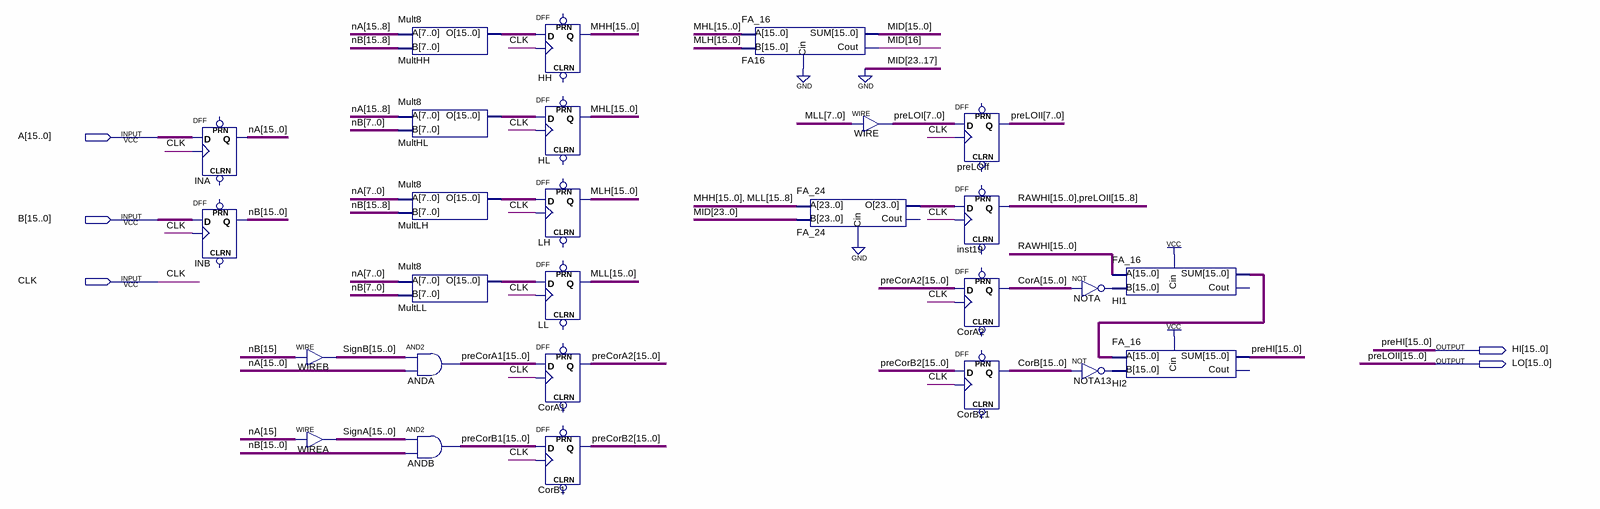
[diagram p0: schematic sheet]
// Quartus schematic Mult16bit_L3.bdf as structural Verilog: 27 symbols, 5 pins
module Mult16bit_L3 (
  input  [15:0] A,
  input  [15:0] B,
  input  CLK,
  output [15:0] HI,
  output [15:0] LO
);

  wire [7:0] preLOI;
  wire [15:0] CorA, CorB, HI1_sum, MHH, MHL, MLH, MLL, MultHH_o, MultHL_o, MultLH_o, MultLL_o, nA, nB,
       NOTA13_out, NOTA_out, preCorA1, preCorA2, preCorB1, preCorB2, RAWHI, SignA, SignB;
  wire [16:0] MID;
  wire [23:0] FA_24_o;

  DFF INA[15:0] (.CLK(CLK), .D(A), .Q(nA));  // open: CLRN, PRN
  DFF INB[15:0] (.CLK(CLK), .D(B), .Q(nB));  // open: CLRN, PRN
  assign SignB = {16{nB[15]}};  // WIRE WIREB
  assign SignA = {16{nA[15]}};  // WIRE WIREA
  Mult8 MultHH (.A(nA[15:8]), .B(nB[15:8]), .O(MultHH_o));
  Mult8 MultHL (.A(nA[15:8]), .B(nB[7:0]), .O(MultHL_o));
  Mult8 MultLH (.A(nA[7:0]), .B(nB[15:8]), .O(MultLH_o));
  Mult8 MultLL (.A(nA[7:0]), .B(nB[7:0]), .O(MultLL_o));
  assign preCorA1 = SignB & nA;  // AND2 ANDA, 16 bits wide
  assign preCorB1 = SignA & nB;  // AND2 ANDB, 16 bits wide
  DFF HH[15:0] (.CLK(CLK), .D(MultHH_o), .Q(MHH));  // open: CLRN, PRN
  DFF HL[15:0] (.CLK(CLK), .D(MultHL_o), .Q(MHL));  // open: CLRN, PRN
  DFF LH[15:0] (.CLK(CLK), .D(MultLH_o), .Q(MLH));  // open: CLRN, PRN
  DFF LL[15:0] (.CLK(CLK), .D(MultLL_o), .Q(MLL));  // open: CLRN, PRN
  DFF CorA1[15:0] (.CLK(CLK), .D(preCorA1), .Q(preCorA2));  // open: CLRN, PRN
  DFF CorB1[15:0] (.CLK(CLK), .D(preCorB1), .Q(preCorB2));  // open: CLRN, PRN
  FA_16 FA16 (.Cin(1'b0), .A(MHL), .B(MLH), .SUM(MID[15:0]), .Cout(MID[16]));
  FA_24 FA_24 (.A({MHH, MLL[15:8]}), .B({{7{1'b0}}, MID}), .Cin(1'b0), .O(FA_24_o));  // open: Cout
  assign preLOI = MLL[7:0];  // WIRE WIRE
  DFF preLOff[7:0] (.CLK(CLK), .D(preLOI), .Q(LO[7:0]));  // open: CLRN, PRN
  DFF inst19[23:0] (.CLK(CLK), .D(FA_24_o), .Q({RAWHI, LO[15:8]}));  // open: CLRN, PRN
  DFF CorA2[15:0] (.CLK(CLK), .D(preCorA2), .Q(CorA));  // open: CLRN, PRN
  DFF CorB21[15:0] (.CLK(CLK), .D(preCorB2), .Q(CorB));  // open: CLRN, PRN
  assign NOTA_out = ~CorA;  // NOT NOTA, 16 bits wide
  assign NOTA13_out = ~CorB;  // NOT NOTA13, 16 bits wide
  FA_16 HI1 (.Cin(1'b1), .A(RAWHI), .B(NOTA_out), .SUM(HI1_sum));  // open: Cout
  FA_16 HI2 (.Cin(1'b1), .A(HI1_sum), .B(NOTA13_out), .SUM(HI));  // open: Cout

  // Other names for the same wires on the sheet: preHI[15:0] = HI; preLOII[15:0] = LO
endmodule
